# Altium schematic sheet E77R.SchDoc
size 431 x 279 mm; SheetNumber: 1; SheetTotal: 1
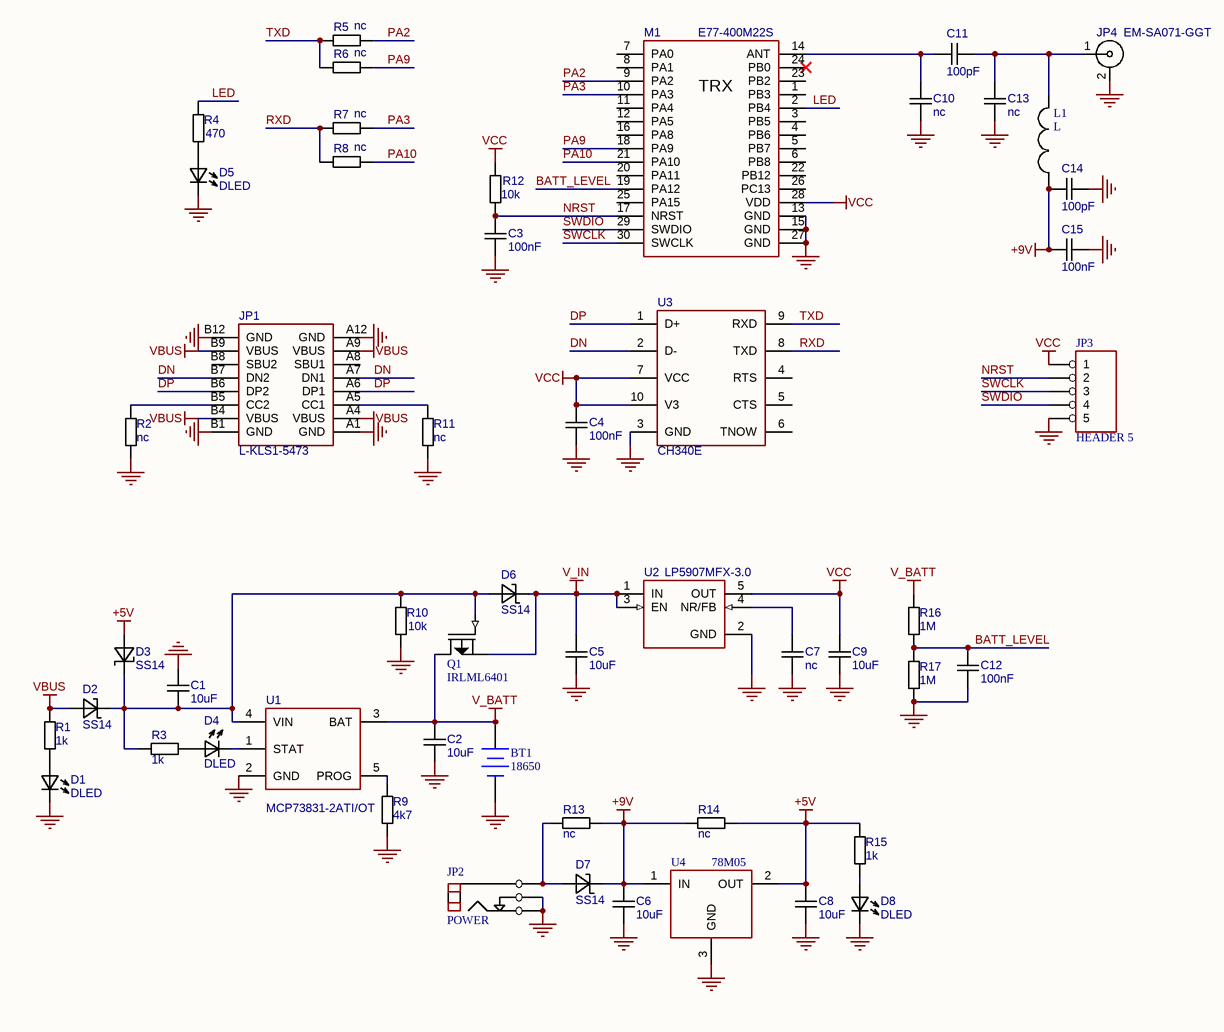
[diagram p0: E77R.SchDoc]

## Parts
BT1  18650  [18650]
C1  10uF  [C-0805]
C2  10uF  [C-0805]
C3  100nF  [C-0603]
C4  100nF  [C-0603]
C5  10uF  [C-0805]
C6  10uF  [C-0805]
C7  nc  [C-0603]
C8  10uF  [C-0805]
C9  10uF  [C-0805]
C10  nc  [C-0603]
C11  100pF  [C-0603]
C12  100nF  [C-0603]
C13  nc  [C-0603]
C14  100pF  [C-0603]
C15  100nF  [C-0603]
D1  DLED  [LED0805]
D2  SS14  [D-SMA]
D3  SS14  [D-SMA]
D4  DLED  [LED0805]
D5  DLED  [LED0805]
D6  SS14  [D-SMA]
D7  SS14  [D-SMA]
D8  DLED  [LED0805]
JP1  L-KLS1-5473  [USB_C_SMD_SLOT]
JP2  POWER  [DC-140-003]
JP3  HEADER 5  [PLS1-5]
JP4  EM-SA071-GGT  [SMA_F_EDGE]
L1  L  [SCI1812]
M1  E77-400M22S  [E77XX-M22]
Q1  IRLML6401  [SOT-23]
R1  1k  [R-0603]
R2  nc  [R-0603]
R3  1k  [R-0603]
R4  470  [R-0603]
R5  nc  [R-0603]
R6  nc  [R-0603]
R7  nc  [R-0603]
R8  nc  [R-0603]
R9  4k7  [R-0603]
R10  10k  [R-0603]
R11  nc  [R-0603]
R12  10k  [R-0603]
R13  nc  [R-0805]
R14  nc  [R-0805]
R15  1k  [R-0603]
R16  1M  [R-0603]
R17  1M  [R-0603]
U1  MCP73831-2ATI/OT  [SOT-23-5]
U2  LP5907MFX-3.0  [SOT-23-5]
U3  CH340E  [MSOP-10]
U4  78M05  [DPAK3]

## Nets
+5V: C8.1 D3.1 R14.1 R15.2 U4.2(OUT)
+9V: C6.1 C14.1 C15.2 D7.2 L1.1 R13.1 R14.2 U4.1(IN)
GND: BT1.2(-) C1.2 C2.1 C3.1 C4.1 C5.2 C6.2 C7.2 C8.2 C9.2 C10.1 C12.1 C13.1 C14.2 C15.1 D1.2 D5.2 D8.2 JP1.A1(GND) JP1.A12(GND) JP1.B1(GND) JP1.B12(GND) JP2.2(C) JP2.3(B) JP3.5 JP4.2 M1.13(GND) M1.15(GND) M1.27(GND) R2.2 R9.1 R10.1 R11.2 R17.1 U1.2(GND) U2.2(GND) U3.3(GND) U4.3(GND)
V_BATT: BT1.1(+) C2.2 Q1.3(DRAIN) R16.2 U1.3(BAT)
V_IN: C5.1 D6.2 Q1.2(SOURCE) U2.1(IN) U2.3(EN)
VBUS: D2.1 JP1.A4(VBUS) JP1.A9(VBUS) JP1.B4(VBUS) JP1.B9(VBUS) R1.2
VCC: C4.2 C9.1 JP3.1 M1.28(VDD) R12.2 U2.5(OUT) U3.7(VCC) U3.10(V3)
BATT_LEVEL: C12.2 M1.19(PA12) R16.1 R17.2
DN: JP1.A7(DN1) JP1.B7(DN2) U3.2(D-)
DP: JP1.A6(DP1) JP1.B6(DP2) U3.1(D+)
LED: M1.2(PB4) R4.2
NRST: C3.2 JP3.2 M1.17(NRST) R12.1
PA2: M1.9(PA2) R5.1
PA3: M1.10(PA3) R7.1
PA9: M1.18(PA9) R6.1
PA10: M1.21(PA10) R8.1
RXD: R7.2 R8.2 U3.8(TXD)
SWCLK: JP3.3 M1.30(SWCLK)
SWDIO: JP3.4 M1.29(SWDIO)
TXD: R5.2 R6.2 U3.9(RXD)
NetC1_1: C1.1 D2.2 D3.2 D6.1 Q1.1(GATE) R3.1 R10.2 U1.4(VIN)
NetC7_1: C7.1 U2.4(NR/FB)
NetC10_2: C10.2 C11.1 M1.14(ANT)
NetC11_2: C11.2 C13.2 JP4.1 L1.2
NetD1_1: D1.1 R1.1
NetD4_1: D4.1 R3.2
NetD4_2: D4.2 U1.1(STAT)
NetD5_1: D5.1 R4.1
NetD7_1: D7.1 JP2.1(A) R13.2
NetD8_1: D8.1 R15.1
NetJP1_A5: JP1.A5(CC1) R11.1
NetJP1_B5: JP1.B5(CC2) R2.1
NetR9_2: R9.2 U1.5(PROG)

Not connected (* = marked no-connect by the designer): JP1 17(VSS) A8(SBU1) B8(SBU2); M1 1(PB3) 3(PB5) 4(PB6) 5(PB7) 6(PB8) 7(PA0) 8(PA1) 11(PA4) 12(PA5) 16(PA8) 20(PA11) 22(PB12) 23(PB2) 24(PB0)* 25(PA15) 26(PC13); U3 4(RTS) 5(CTS) 6(TNOW)

## Notes on the sheet
- DWG. NO.
- REV.
- SHT.
- THIS DOCUMENT AND THE DATA DISCLOSED HEREIN OR HEREWITH IS THE PROPERTY OF ALTIUM LIMITED AND MAY BE FREELY DISTRIBUTED IN WHOLE. NO RIGHTS ARE RESERVED OR EXPRESS OR IMPLIED WARANTEE GIVEN.
- REVISION
- DESCRIPTION
- DATE
- APPROVED
- ENG:
- APPROVALS
- PROJECT
- DSN:
- CHK:
- REFERENCE DOCUMENTS
- PROJECT REVISION:
- TITLE
- DOCUMENT REVISION:
- DESIGN ITEM:
- BOM:
- FAB DWG:
- PCB DWG:
- ASSY DWG:
- SCALE:
- SIZE
- B
- CAGE CODE
- FILE NAME
- DWG NO.
- SHEET
- OF
- REV
- (in symbol E77-400M22S) TRX

## Library data of the parts
BT1 = Battery: Multicell Battery; Published: 24-Mar-1999; LatestRevisionDate: 17-Jul-2002; LatestRevisionNote: Re-released for DXP Platform.; PackageReference: BAT-2; Publisher: Altium Limited; PackageDescription: Battery; 2 Leads; Value: 18650
C1-C15 = CAPN: Voltage: 50V; Точність/група: NP0; Вид: Конденсатор
D1 D4 D5 D8 = DLED: Вид: Світлодіод
D2 D3 D6 D7 = DIODSH: Вид: Діод
JP1 = L-KLS1-5473: Mounting  Method: SMD; Value: *
JP2 = POWER: Вид: Роз'єм; *: *
JP3 = HEADER 5: Вид: Роз'єм; *: *
JP4 = SMA: SMA Female R/A PCB Mount; Вид: Роз'єм
L1 = L: Вид: Індуктивність
Q1 = MOSF-P: Вид: Транзистор
R1-R17 = RES: Точність/група: 5%; Вид: Резистор
U1 = MCP73831-2ATI/OT: Library Part: IC`s.SchLib; Manufacturer: Texas Instruments; Man#Part Num#: TPS61023DRLT; Value: {Value}; Mounting  Method: SMD; IC Type: PMIC; Part Number: MCP73831-2ATI/OT; Footprint Part: IC-package.PcbLib; Package: SOT-563; Part Type: IC; Component Type: SMD; Temperature Range: -40°C ~ 125°C (TJ); URL: https://www.ti.com/general/docs/suppproductinfo.tsp?distId=10&gotoUrl=https%3A%2F%2Fwww.ti.com%2Flit%2Fgpn%2Ftps61023; Suplier 1: https://www.digikey.com.au/en/products/detail/texas-instruments/TPS61023DRLT/11310622?s=N4IgTCBcDaICoAUDKA2AjABjAZgCICUAZOEAXQF8g
U2 = LP5907: 250mA Low-Dropout Regulator; Вид: Мікросхема
U3 = CH340E: Value: {Value}; Mounting  Method: SMD
U4 = 78M08: Вид: Мікросхема